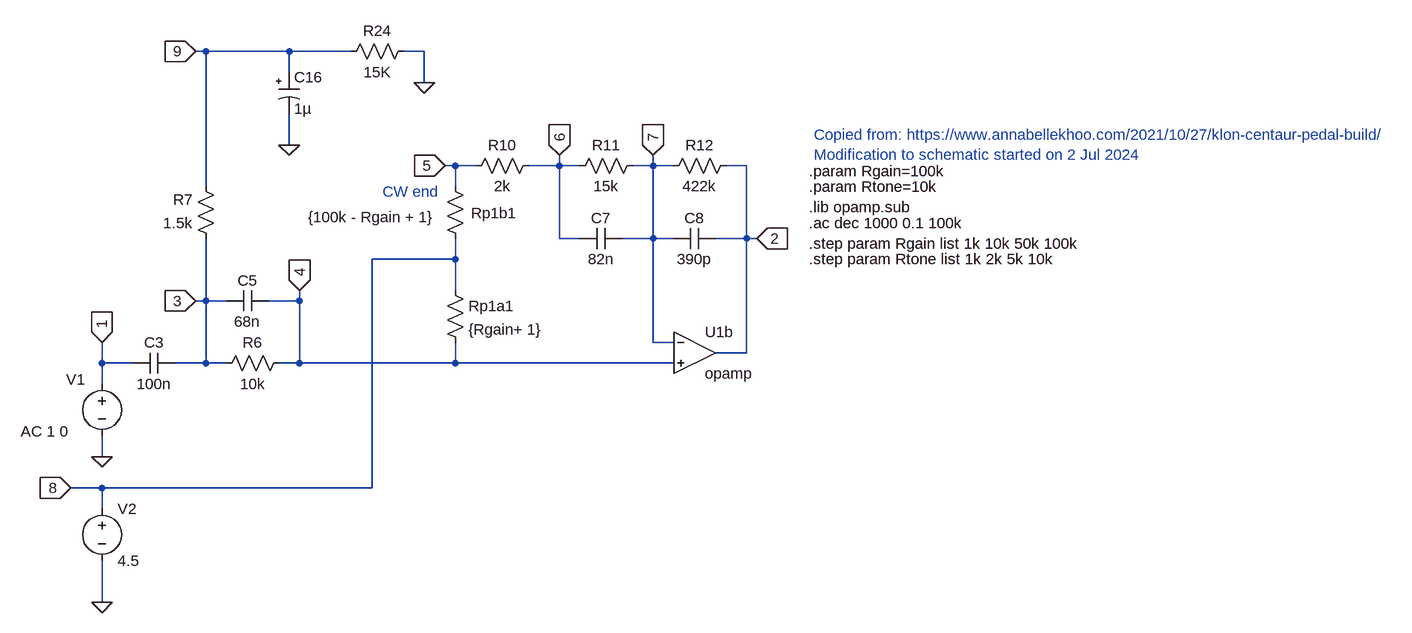
[diagram p0: schematic Klon-Centaur_clipped_path.asc]
Klon-Centaur_clipped_path.asc, the LTspice schematic file:
Version 4
SHEET 1 4496 5064
WIRE 96 2080 80 2080
WIRE 224 2080 96 2080
WIRE 320 2080 224 2080
WIRE 432 2080 400 2080
WIRE 224 2112 224 2080
WIRE 432 2128 432 2080
WIRE 224 2224 224 2176
WIRE 480 2256 464 2256
WIRE 512 2256 480 2256
WIRE 640 2256 640 2240
WIRE 640 2256 592 2256
WIRE 672 2256 640 2256
WIRE 784 2256 784 2240
WIRE 784 2256 752 2256
WIRE 816 2256 784 2256
WIRE 928 2256 896 2256
WIRE 96 2288 96 2080
WIRE 480 2288 480 2256
WIRE 640 2368 640 2256
WIRE 672 2368 640 2368
WIRE 784 2368 784 2256
WIRE 784 2368 736 2368
WIRE 816 2368 784 2368
WIRE 928 2368 928 2256
WIRE 928 2368 880 2368
WIRE 944 2368 928 2368
WIRE 480 2400 480 2368
WIRE 480 2400 352 2400
WIRE 480 2448 480 2400
WIRE 96 2464 96 2368
WIRE 96 2464 80 2464
WIRE 128 2464 96 2464
WIRE 240 2464 240 2448
WIRE 240 2464 192 2464
WIRE 784 2528 784 2368
WIRE 816 2528 784 2528
WIRE 928 2544 928 2368
WIRE 928 2544 880 2544
WIRE -64 2560 -64 2528
WIRE -16 2560 -64 2560
WIRE 96 2560 96 2464
WIRE 96 2560 48 2560
WIRE 128 2560 96 2560
WIRE 240 2560 240 2464
WIRE 240 2560 208 2560
WIRE 480 2560 480 2528
WIRE 480 2560 240 2560
WIRE 816 2560 480 2560
WIRE -64 2592 -64 2560
WIRE -64 2704 -64 2672
WIRE -64 2752 -112 2752
WIRE 352 2752 352 2400
WIRE 352 2752 -64 2752
WIRE -64 2784 -64 2752
WIRE -64 2928 -64 2864
FLAG -64 2528 1
IOPIN -64 2528 In
FLAG 224 2224 0
FLAG -64 2928 0
FLAG -64 2704 0
FLAG 80 2464 3
IOPIN 80 2464 In
FLAG 80 2080 9
IOPIN 80 2080 In
FLAG 240 2448 4
IOPIN 240 2448 In
FLAG 464 2256 5
IOPIN 464 2256 In
FLAG 640 2240 6
IOPIN 640 2240 In
FLAG 784 2240 7
IOPIN 784 2240 In
FLAG 944 2368 2
IOPIN 944 2368 In
FLAG -112 2752 8
IOPIN -112 2752 In
FLAG 432 2128 0
SYMBOL voltage -64 2576 R0
WINDOW 0 -55 9 Left 2
WINDOW 123 -125 89 Left 2
WINDOW 39 0 0 Left 0
WINDOW 3 -289 58 Left 2
SYMATTR InstName V1
SYMATTR Value2 AC 1 0
SYMATTR Value ""
SYMBOL cap 48 2544 R90
WINDOW 0 0 32 VBottom 2
WINDOW 3 32 32 VTop 2
SYMATTR InstName C3
SYMATTR Value 100n
SYMBOL res 224 2544 R90
WINDOW 0 0 56 VBottom 2
WINDOW 3 32 56 VTop 2
SYMATTR InstName R6
SYMATTR Value 10k
SYMBOL cap 192 2448 R90
WINDOW 0 0 32 VBottom 2
WINDOW 3 32 32 VTop 2
SYMATTR InstName C5
SYMATTR Value 68n
SYMBOL res 464 2272 R0
WINDOW 0 40 57 Left 2
WINDOW 3 -211 63 Left 2
SYMATTR InstName Rp1b1
SYMATTR Value {100k - Rgain + 1}
SYMBOL res 464 2432 R0
SYMATTR InstName Rp1a1
SYMATTR Value {Rgain+ 1}
SYMBOL res 608 2240 R90
WINDOW 0 0 56 VBottom 2
WINDOW 3 32 56 VTop 2
SYMATTR InstName R10
SYMATTR Value 2k
SYMBOL res 768 2240 R90
WINDOW 0 0 56 VBottom 2
WINDOW 3 32 56 VTop 2
SYMATTR InstName R11
SYMATTR Value 15k
SYMBOL cap 736 2352 R90
WINDOW 0 0 32 VBottom 2
WINDOW 3 32 32 VTop 2
SYMATTR InstName C7
SYMATTR Value 82n
SYMBOL cap 880 2352 R90
WINDOW 0 0 32 VBottom 2
WINDOW 3 32 32 VTop 2
SYMATTR InstName C8
SYMATTR Value 390p
SYMBOL res 912 2240 R90
WINDOW 0 0 56 VBottom 2
WINDOW 3 32 56 VTop 2
SYMATTR InstName R12
SYMATTR Value 422k
SYMBOL res 112 2384 R180
WINDOW 0 36 76 Left 2
WINDOW 3 36 40 Left 2
SYMATTR InstName R7
SYMATTR Value 1.5k
SYMBOL res 416 2064 R90
WINDOW 0 0 56 VBottom 2
WINDOW 3 32 56 VTop 2
SYMATTR InstName R24
SYMATTR Value 15K
SYMBOL voltage -64 2768 R0
WINDOW 123 0 0 Left 0
WINDOW 39 0 0 Left 0
SYMATTR InstName V2
SYMATTR Value 4.5
SYMBOL OpAmps\\opamp 848 2480 R0
SYMATTR InstName U1b
SYMBOL polcap 208 2112 R0
SYMATTR InstName C16
SYMATTR Value 1µ
TEXT 1024 2264 Left 2 !.param Rgain=100k
TEXT 1024 2288 Left 2 !.param Rtone=10k
TEXT 1032 2208 Left 2 ;Copied from: https://www.annabellekhoo.com/2021/10/27/klon-centaur-pedal-build/\nModification to schematic started on 2 Jul 2024
TEXT 1024 2320 Left 2 !.lib opamp.sub
TEXT 1024 2344 Left 2 !.ac dec 1000 0.1 100k
TEXT 368 2296 Left 2 ;CW end
TEXT 1024 2376 Left 2 !.step param Rgain list 1k 10k 50k 100k
TEXT 1024 2400 Left 2 !.step param Rtone list 1k 2k 5k 10k

The netlist it stands for:
* Klon-Centaur_clipped_path.asc
V1 1 0 AC 1 0
C3 3 1 100n
R6 4 3 10k
C5 4 3 68n
Rp1b1 5 8 {100k - Rgain + 1}
Rp1a1 8 4 {Rgain+ 1}
R10 6 5 2k
R11 7 6 15k
C7 7 6 82n
C8 2 7 390p
R12 2 7 422k
R7 3 9 1.5k
R24 0 9 15K
V2 8 0 4.5
XU1b 7 4 2 opamp Aol=100K GBW=10Meg  ; pins invin noninvin out
C16 9 0 1µ
.param Rgain=100k
.param Rtone=10k
* Copied from: https://www.annabellekhoo.com/2021/10/27/klon-centaur-pedal-build/
* Modification to schematic started on 2 Jul 2024
.lib opamp.sub
.ac dec 1000 0.1 100k
* CW end
.step param Rgain list 1k 10k 50k 100k
.step param Rtone list 1k 2k 5k 10k
.backanno
.end